# EAGLE design matrix (EAGLE 9.5.2)
CNAME: Control Cube; CREVISION: 01; DESIGNER: Heng Teng Yi
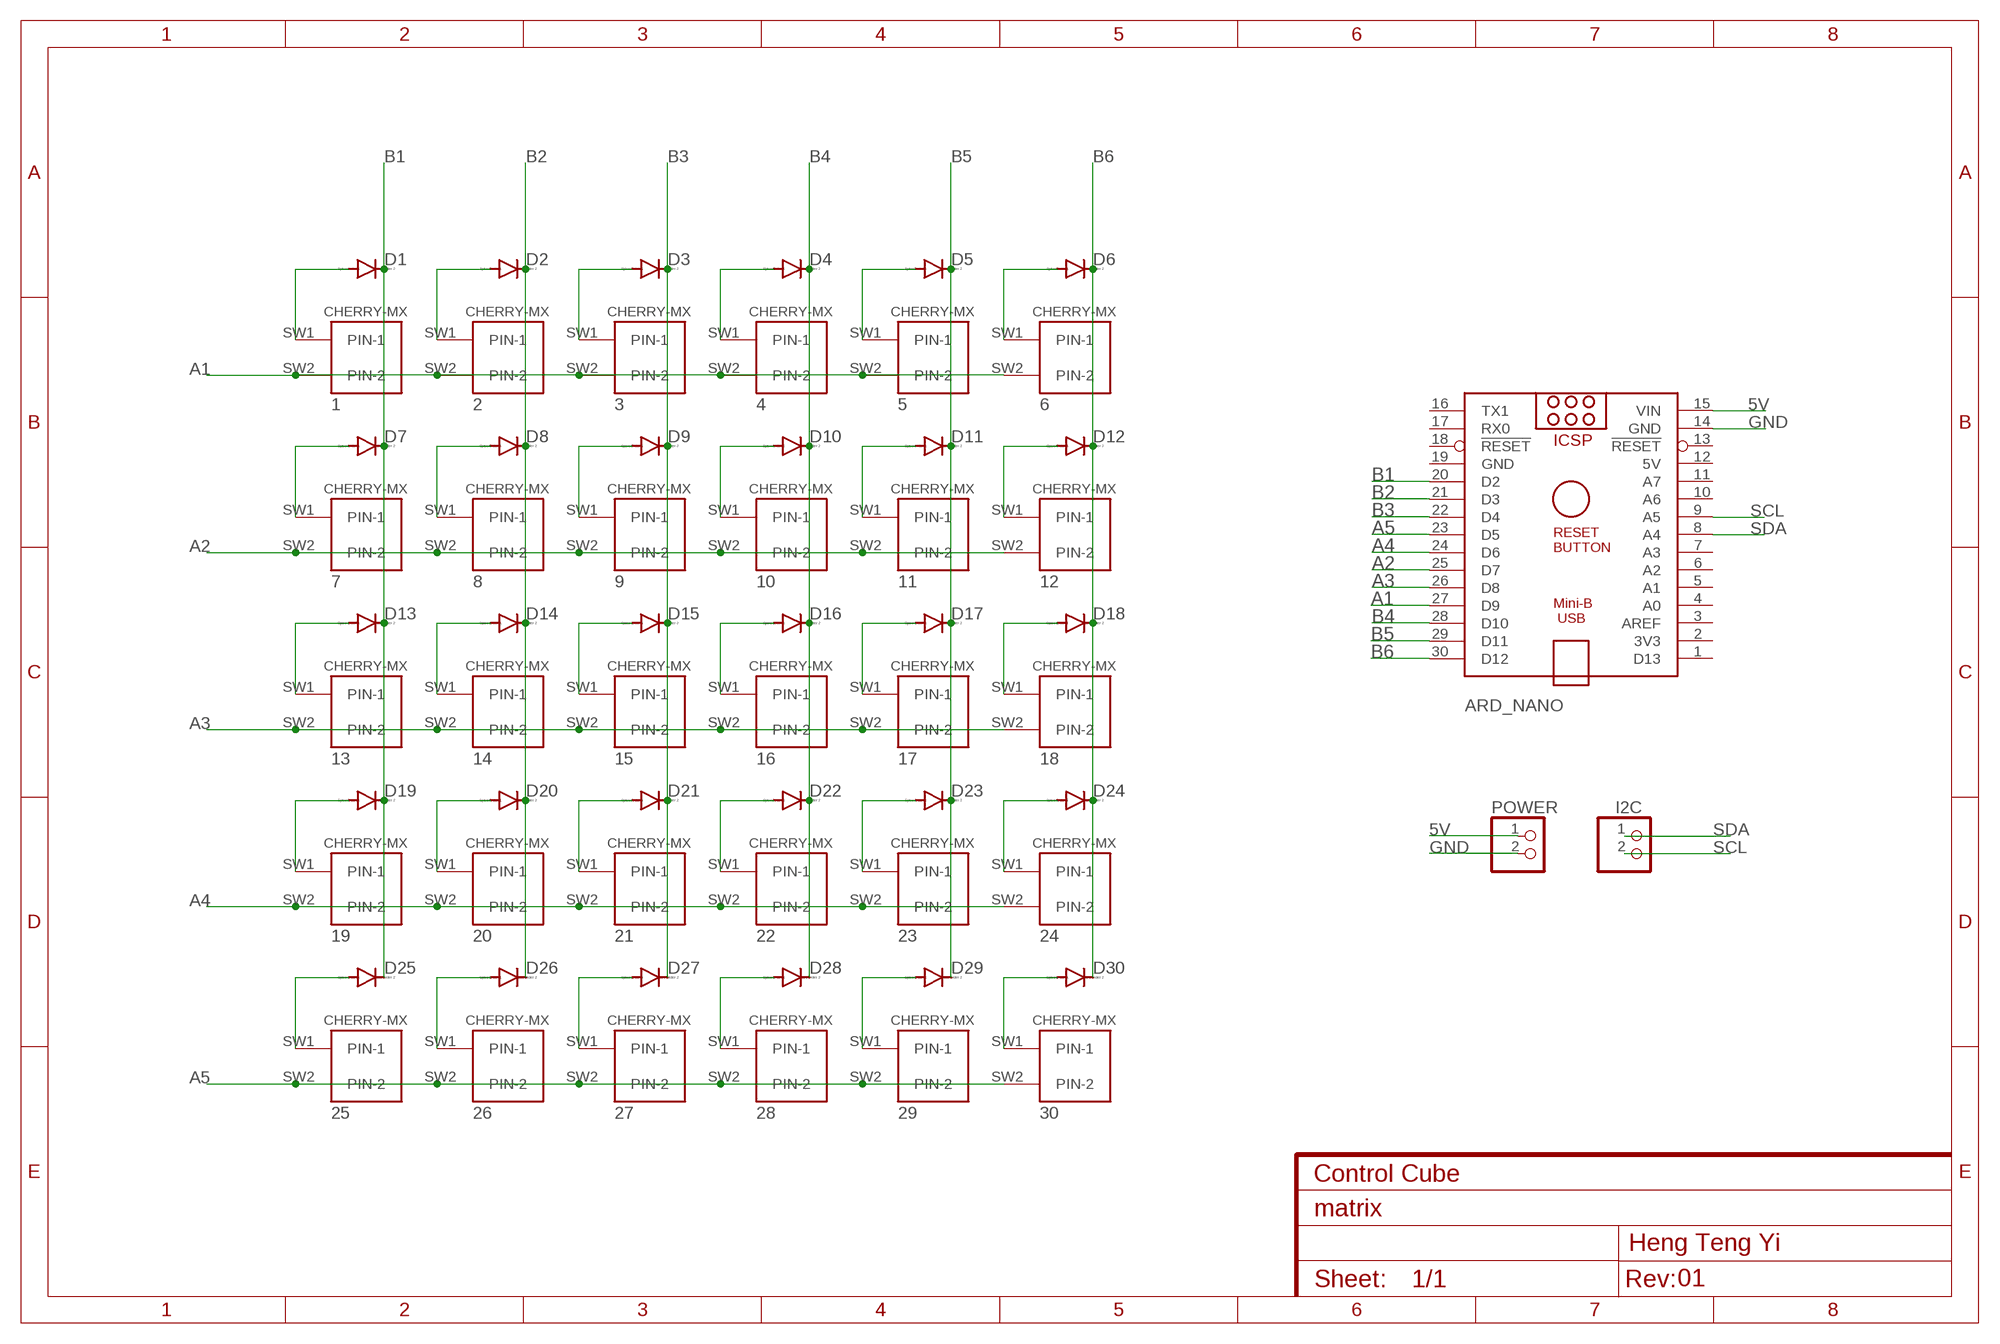
[diagram p0: schematic, sheet 1]

## Parts
1  CHERRY-MX  [CHERRY-MX]
2  CHERRY-MX  [CHERRY-MX]
3  CHERRY-MX  [CHERRY-MX]
4  CHERRY-MX  [CHERRY-MX]
5  CHERRY-MX  [CHERRY-MX]
6  CHERRY-MX  [CHERRY-MX]
7  CHERRY-MX  [CHERRY-MX]
8  CHERRY-MX  [CHERRY-MX]
9  CHERRY-MX  [CHERRY-MX]
10  CHERRY-MX  [CHERRY-MX]
11  CHERRY-MX  [CHERRY-MX]
12  CHERRY-MX  [CHERRY-MX]
13  CHERRY-MX  [CHERRY-MX]
14  CHERRY-MX  [CHERRY-MX]
15  CHERRY-MX  [CHERRY-MX]
16  CHERRY-MX  [CHERRY-MX]
17  CHERRY-MX  [CHERRY-MX]
18  CHERRY-MX  [CHERRY-MX]
19  CHERRY-MX  [CHERRY-MX]
20  CHERRY-MX  [CHERRY-MX]
21  CHERRY-MX  [CHERRY-MX]
22  CHERRY-MX  [CHERRY-MX]
23  CHERRY-MX  [CHERRY-MX]
24  CHERRY-MX  [CHERRY-MX]
25  CHERRY-MX  [CHERRY-MX]
26  CHERRY-MX  [CHERRY-MX]
27  CHERRY-MX  [CHERRY-MX]
28  CHERRY-MX  [CHERRY-MX]
29  CHERRY-MX  [CHERRY-MX]
30  CHERRY-MX  [CHERRY-MX]
ARD_NANO  ARDUINO_NANO  [ARDUINO_NANO]
D1  1N4148DO35-7  [DO35-7]
D2  1N4148DO35-7  [DO35-7]
D3  1N4148DO35-7  [DO35-7]
D4  1N4148DO35-7  [DO35-7]
D5  1N4148DO35-7  [DO35-7]
D6  1N4148DO35-7  [DO35-7]
D7  1N4148DO35-7  [DO35-7]
D8  1N4148DO35-7  [DO35-7]
D9  1N4148DO35-7  [DO35-7]
D10  1N4148DO35-7  [DO35-7]
D11  1N4148DO35-7  [DO35-7]
D12  1N4148DO35-7  [DO35-7]
D13  1N4148DO35-7  [DO35-7]
D14  1N4148DO35-7  [DO35-7]
D15  1N4148DO35-7  [DO35-7]
D16  1N4148DO35-7  [DO35-7]
D17  1N4148DO35-7  [DO35-7]
D18  1N4148DO35-7  [DO35-7]
D19  1N4148DO35-7  [DO35-7]
D20  1N4148DO35-7  [DO35-7]
D21  1N4148DO35-7  [DO35-7]
D22  1N4148DO35-7  [DO35-7]
D23  1N4148DO35-7  [DO35-7]
D24  1N4148DO35-7  [DO35-7]
D25  1N4148DO35-7  [DO35-7]
D26  1N4148DO35-7  [DO35-7]
D27  1N4148DO35-7  [DO35-7]
D28  1N4148DO35-7  [DO35-7]
D29  1N4148DO35-7  [DO35-7]
D30  1N4148DO35-7  [DO35-7]
I2C  PINHD-1X2/90  [1X02/90]
POWER  PINHD-1X2/90  [1X02/90]

## Nets
5V: ARD_NANO.15(VIN) POWER.1
A1: 1.SW2(PIN-2) 2.SW2(PIN-2) 3.SW2(PIN-2) 4.SW2(PIN-2) 5.SW2(PIN-2) 6.SW2(PIN-2) ARD_NANO.27(D9)
A2: 7.SW2(PIN-2) 8.SW2(PIN-2) 9.SW2(PIN-2) 10.SW2(PIN-2) 11.SW2(PIN-2) 12.SW2(PIN-2) ARD_NANO.25(D7)
A3: 13.SW2(PIN-2) 14.SW2(PIN-2) 15.SW2(PIN-2) 16.SW2(PIN-2) 17.SW2(PIN-2) 18.SW2(PIN-2) ARD_NANO.26(D8)
A4: 19.SW2(PIN-2) 20.SW2(PIN-2) 21.SW2(PIN-2) 22.SW2(PIN-2) 23.SW2(PIN-2) 24.SW2(PIN-2) ARD_NANO.24(D6)
A5: 25.SW2(PIN-2) 26.SW2(PIN-2) 27.SW2(PIN-2) 28.SW2(PIN-2) 29.SW2(PIN-2) 30.SW2(PIN-2) ARD_NANO.23(D5)
B1: ARD_NANO.20(D2) D1.C D7.C D13.C D19.C D25.C
B2: ARD_NANO.21(D3) D2.C D8.C D14.C D20.C D26.C
B3: ARD_NANO.22(D4) D3.C D9.C D15.C D21.C D27.C
B4: ARD_NANO.28(D10) D4.C D10.C D16.C D22.C D28.C
B5: ARD_NANO.29(D11) D5.C D11.C D17.C D23.C D29.C
B6: ARD_NANO.30(D12) D6.C D12.C D18.C D24.C D30.C
GND: ARD_NANO.14(GND) POWER.2
N$1: 1.SW1(PIN-1) D1.A
N$2: 2.SW1(PIN-1) D2.A
N$3: 3.SW1(PIN-1) D3.A
N$4: 4.SW1(PIN-1) D4.A
N$5: 5.SW1(PIN-1) D5.A
N$6: 6.SW1(PIN-1) D6.A
N$7: 7.SW1(PIN-1) D7.A
N$8: 8.SW1(PIN-1) D8.A
N$9: 9.SW1(PIN-1) D9.A
N$10: 10.SW1(PIN-1) D10.A
N$11: 11.SW1(PIN-1) D11.A
N$12: 12.SW1(PIN-1) D12.A
N$13: 13.SW1(PIN-1) D13.A
N$14: 14.SW1(PIN-1) D14.A
N$15: 15.SW1(PIN-1) D15.A
N$16: 16.SW1(PIN-1) D16.A
N$17: 17.SW1(PIN-1) D17.A
N$18: 18.SW1(PIN-1) D18.A
N$19: 19.SW1(PIN-1) D19.A
N$20: 20.SW1(PIN-1) D20.A
N$21: 21.SW1(PIN-1) D21.A
N$22: 22.SW1(PIN-1) D22.A
N$23: 23.SW1(PIN-1) D23.A
N$24: 24.SW1(PIN-1) D24.A
N$25: 30.SW1(PIN-1) D30.A
N$26: 29.SW1(PIN-1) D29.A
N$27: 28.SW1(PIN-1) D28.A
N$28: 27.SW1(PIN-1) D27.A
N$29: 25.SW1(PIN-1) D25.A
N$30: 26.SW1(PIN-1) D26.A
SCL: ARD_NANO.9(A5) I2C.2
SDA: ARD_NANO.8(A4) I2C.1
Unconnected: ARD_NANO.1(D13) ARD_NANO.2(3V3) ARD_NANO.3(AREF) ARD_NANO.4(A0) ARD_NANO.5(A1) ARD_NANO.6(A2) ARD_NANO.7(A3) ARD_NANO.10(A6) ARD_NANO.11(A7) ARD_NANO.13(!RESET) ARD_NANO.16(TX1) ARD_NANO.17(RX0) ARD_NANO.18(!RESET)

## Notes on the sheet
- Control Cube
- Heng Teng Yi
- 01

## Power pins joined to a net without a drawn wire
5V: ARD_NANO.12(5V)
GND: ARD_NANO.19(GND)

## Library data of the parts
1-30 = cherrymx:CHERRY-MX: Cherry MX series keyswitch
ARD_NANO = ArduinoNanoV30:ARDUINO_NANO: Arduino Nano V3.0 Overview: The Arduino Nano is a small, complete, and breadboard-friendly board based on the ATmega328 (Arduino Nano 3.x) or ATmega168 (Arduino Nano 2.x). It has more or less the same functionality of the Arduino Duemilanove, but in a different package. It lacks only a DC power jack, and works with a Mini-B USB cable instead of a standard one. The Nano was designed and is being produced by Gravitech. Specifications: Microcontroller Atmel ATmega168 or ATmega328 Operating Voltage (logic level) 5 V Input Voltage (recommended) 7-12 V Input Voltage (limits) 6-20 V Digital I/O Pins 14 (of which 6 provide PWM output) Analog Input Pins 8 DC Current per I/O Pin 40 mA Flash Memory 16 KB (ATmega168) or 32 KB (ATmega328) of which 2 KB used by bootloader SRAM 1 KB (ATmega168) or 2 KB (ATmega328) EEPROM 512 bytes (ATmega168) or 1 KB (ATmega328) Clock Speed 16 MHz Dimensions 0.73" x 1.70" Length 45 mm Width 18 mm Weigth 5 g Power: The Arduino Nano can be powered via the Mini-B USB connection, 6-20V unregulated external power supply (pin 30), or 5V regulated external power supply (pin 27). The power source is automatically selected to the highest voltage source. Memory: The ATmega168 has 16 KB of flash memory for storing code (of which 2 KB is used for the bootloader); the ATmega328 has 32 KB, (also with 2 KB used for the bootloader). The ATmega168 has 1 KB of SRAM and 512 bytes of EEPROM (which can be read and written with the EEPROM library); the ATmega328 has 2 KB of SRAM and 1 KB of EEPROM. Input and Output: Each of the 14 digital pins on the Nano can be used as an input or output, using pinMode(), digitalWrite(), and digitalRead() functions. They operate at 5 volts. Each pin can provide or receive a maximum of 40 mA and has an internal pull-up resistor (disconnected by default) of 20-50 kOhms. In addition, some pins have specialized functions. Visit Arduino - ArduinoBoardNano <https://www.arduino.cc/en/Main/ArduinoBoardNano>
D1-D30 = diode:1N4148: DIODE high speed (Philips)
I2C POWER = pinhead:PINHD-1X2: PIN HEADER

## Board
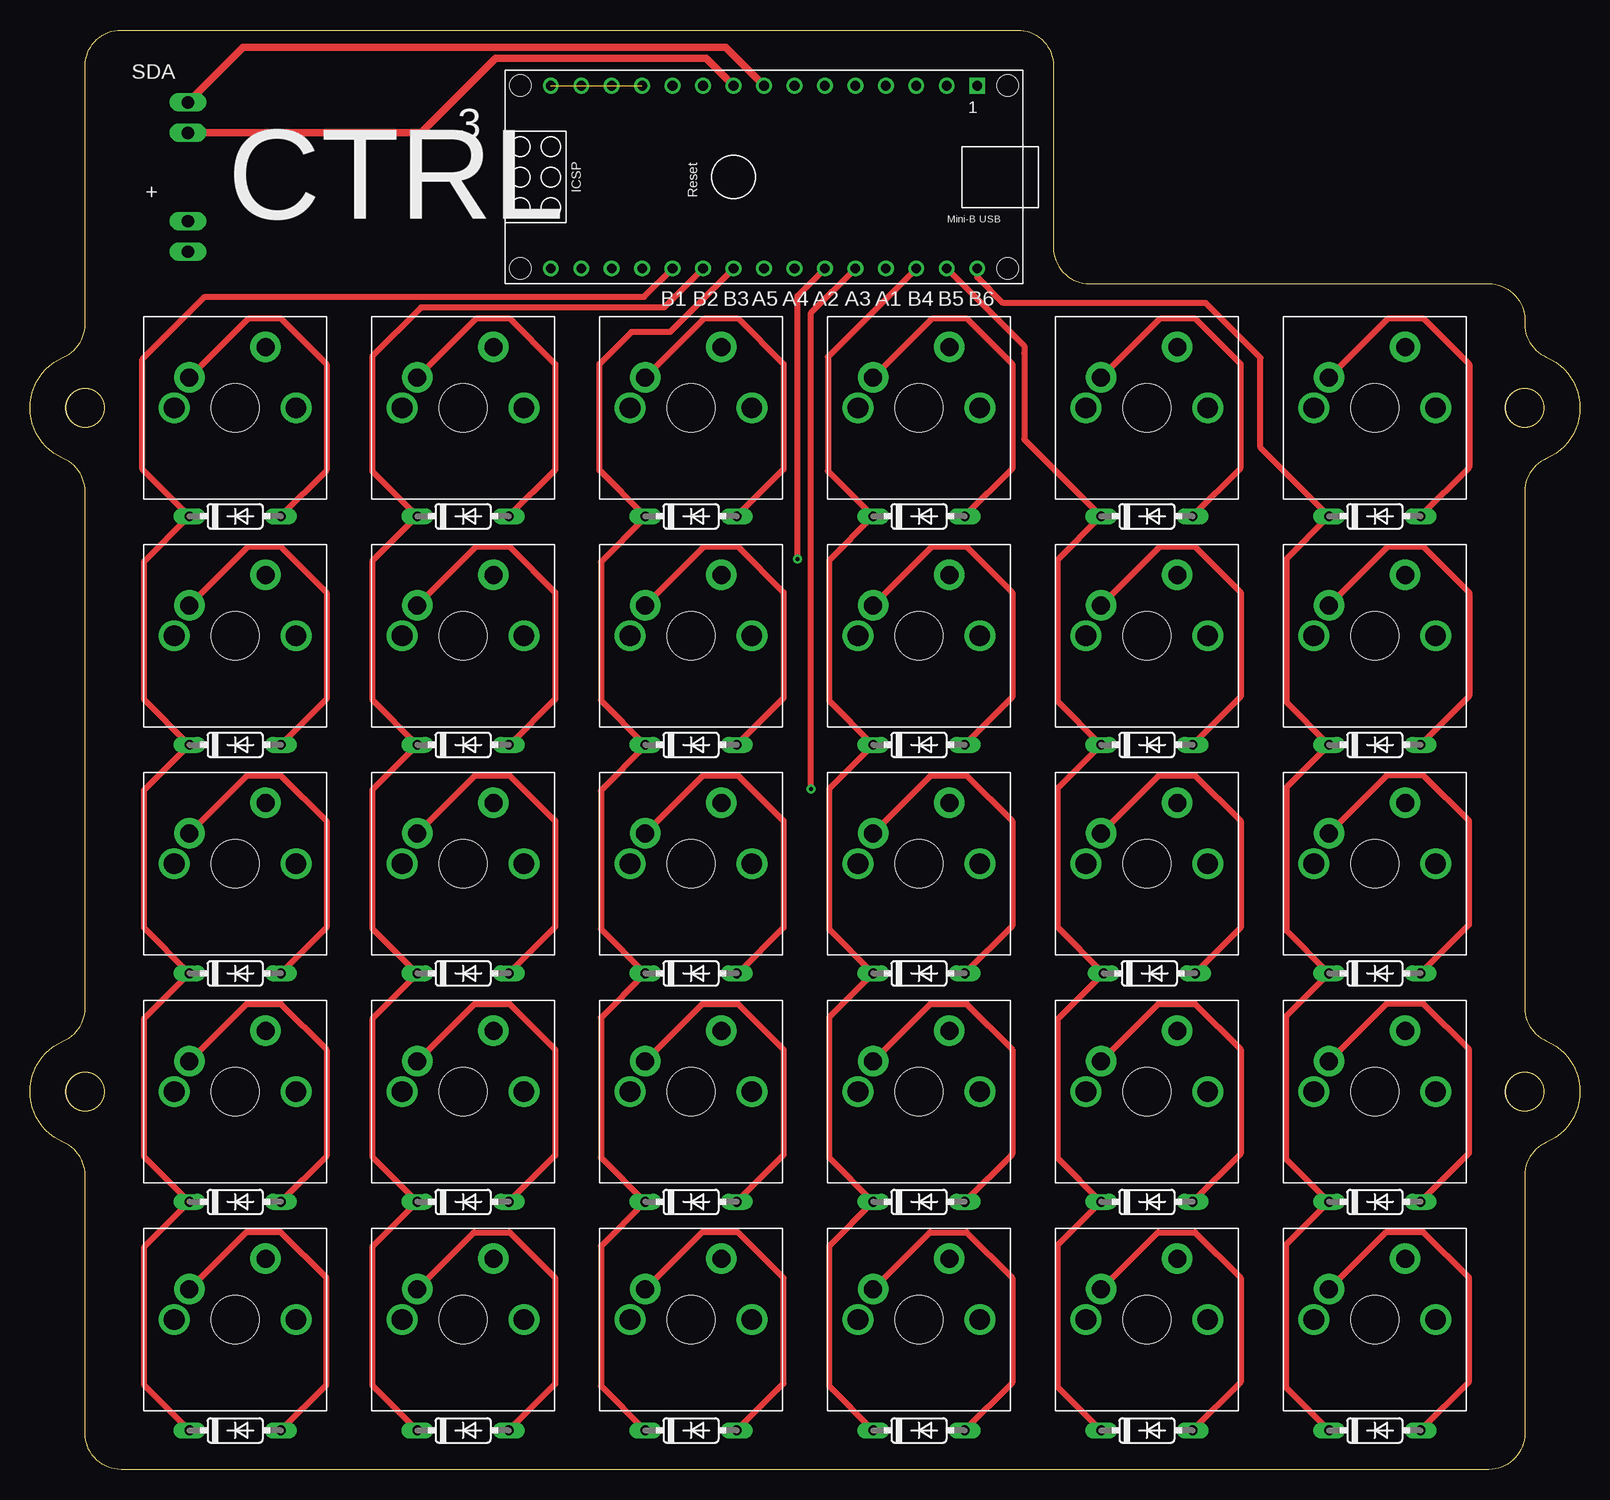
[diagram p1: board, top side]
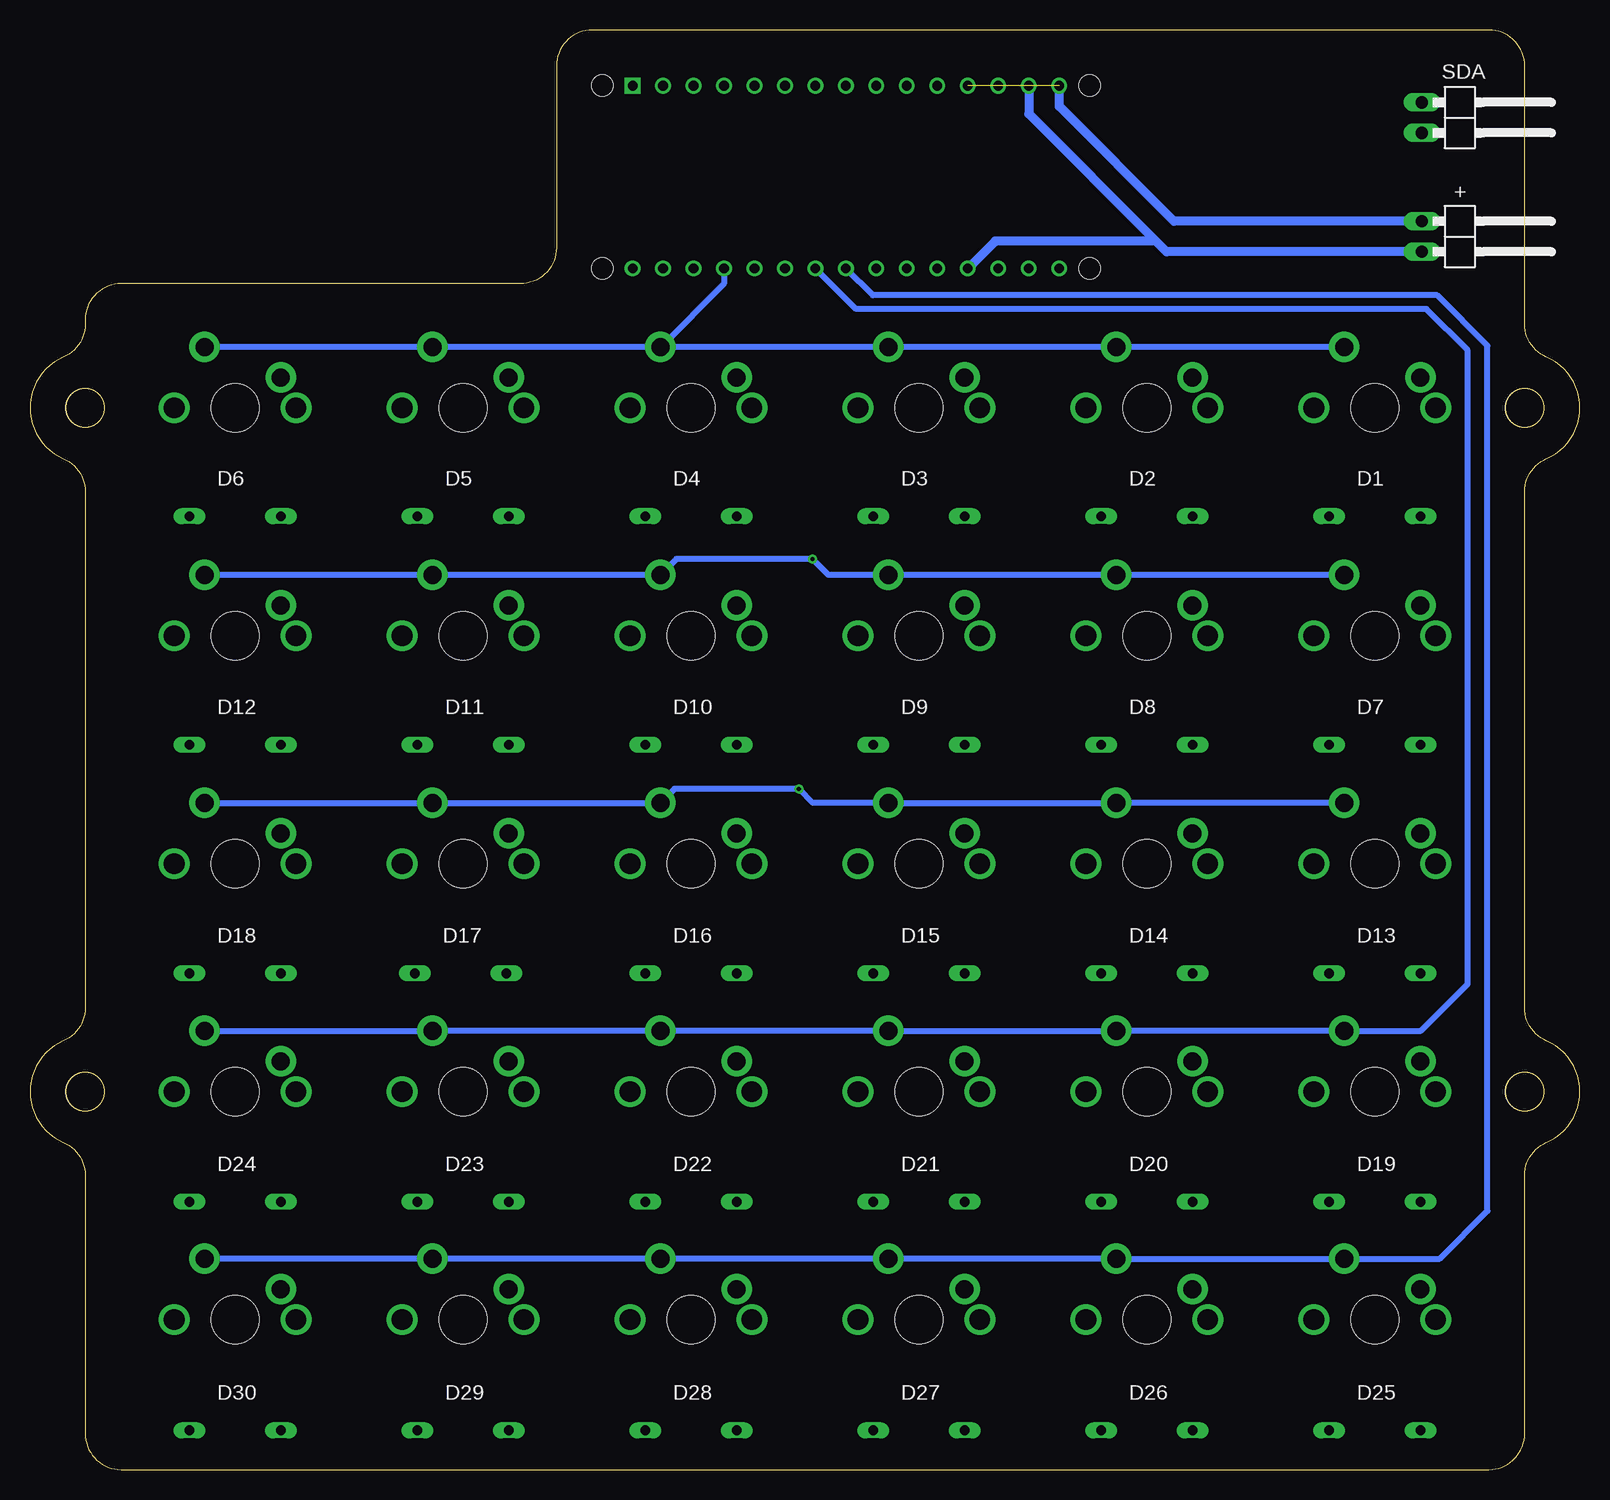
[diagram p2: board, bottom side, seen from below]

Size 129.2 x 120 mm. Coordinates in mm from the lower left corner, seen from the top.
Outline: 88.32,98.85 121.6,98.85 arc-90 124.6,95.85 124.6,95.48 arc67 126.42,92.73 arc-134 126.42,84.27 arc67 124.6,81.52 124.6,38.48 arc67 126.42,35.73 arc-134 126.42,27.27 arc67 124.6,24.52 124.6,3 arc-90 121.6,0 7.6,0 arc-90 4.6,3 4.6,24.52 arc67 2.78,27.27 arc-134 2.78,35.73 arc67 4.6,38.48 4.6,81.52 arc67 2.78,84.27 arc-134 2.78,92.73 arc67 4.6,95.48 4.6,117 arc-90 7.6,120 82.32,120 arc-90 85.32,117 85.32,101.85 arc90 88.32,98.85
Outline: circle at 4.6,31.5 radius 1.6
Outline: circle at 4.6,88.5 radius 1.6
Outline: circle at 124.6,31.5 radius 1.6
Outline: circle at 124.6,88.5 radius 1.6
Copper layers (1*16): Top 0.035mm / dielectric 1.5mm / Bottom 0.035mm
Design rules "default": minimum track width 6mil, minimum drill 0.35mm, track to track 6mil, track to pad 6mil, pad to pad 6mil, via to via 6mil, smd to smd 6mil, copper to edge 40mil, drill to drill 6mil, minimum pad ring 10mil, minimum via ring 8mil, stop-mask expansion 4mil, vias tented up to drill 0mil, thermal gap 10mil
Holes 3.2 mm at 4.6,88.5 4.6,31.5 124.6,31.5 124.6,88.5

### Footprints (pad centres in the part's own frame; a part is rotated, then mirrored left to right if it is on the bottom)
CHERRY-MX = drill 1.714 pad 1.93: P$3 -5.08,0; P$4 5.08,0 | drill 1.5 pad 2.54: SW1 -3.81,2.54; SW2 2.54,5.08 | hole 4: 0,0
ARDUINO_NANO = drill 0.8 square: 1 -20.32,-7.62 | drill 0.8: 2 -17.78,-7.62; 3 -15.24,-7.62; 4 -12.7,-7.62; 5 -10.16,-7.62; 6 -7.62,-7.62; 7 -5.08,-7.62; 8 -2.54,-7.62; 9 0,-7.62; 10 2.54,-7.62; 11 5.08,-7.62; 12 7.62,-7.62; 13 10.16,-7.62; 14 12.7,-7.62; 15 15.24,-7.62; 16 15.24,7.62; 17 12.7,7.62; 18 10.16,7.62; 19 7.62,7.62; 20 5.08,7.62; 21 2.54,7.62; 22 0,7.62; 23 -2.54,7.62; 24 -5.08,7.62; 25 -7.62,7.62; 26 -10.16,7.62; 27 -12.7,7.62; 28 -15.24,7.62; 29 -17.78,7.62; 30 -20.32,7.62 | hole 1.778: -22.86,-7.62; -22.86,7.62; 17.78,7.62; 17.78,-7.62
DO35-7 = drill 0.813 long: A 3.81,0; C -3.81,0
1X02/90 = drill 1.016 long: 1 -1.27,-3.81; 2 1.27,-3.81

### Placement (x,y rotation side)
1  17.1,88.5 0 top
2  36.1,88.5 0 top
3  55.1,88.5 0 top
4  74.1,88.5 0 top
5  93.1,88.5 0 top
6  112.1,88.5 0 top
7  17.1,69.5 0 top
8  36.1,69.5 0 top
9  55.1,69.5 0 top
10  74.1,69.5 0 top
11  93.1,69.5 0 top
12  112.1,69.5 0 top
13  17.1,50.5 0 top
14  36.1,50.5 0 top
15  55.1,50.5 0 top
16  74.1,50.5 0 top
17  93.1,50.5 0 top
18  112.1,50.5 0 top
19  17.1,31.5 0 top
20  36.1,31.5 0 top
21  55.1,31.5 0 top
22  74.1,31.5 0 top
23  93.1,31.5 0 top
24  112.1,31.5 0 top
25  17.1,12.5 0 top
26  36.1,12.5 0 top
27  55.1,12.5 0 top
28  74.1,12.5 0 top
29  93.1,12.5 0 top
30  112.1,12.5 0 top
ARD_NANO  58.65,107.74 180 top
D1  17.1,79.46 0 top
D2  36.1,79.46 0 top
D3  55.1,79.46 0 top
D4  74.1,79.46 0 top
D5  93.1,79.46 0 top
D6  112.1,79.46 0 top
D7  17.1,60.41 0 top
D8  36.1,60.41 0 top
D9  55.1,60.41 0 top
D10  74.1,60.41 0 top
D11  93.1,60.41 0 top
D12  112.1,60.41 0 top
D13  17.1,41.36 0 top
D14  36.1,41.36 0 top
D15  55.1,41.36 0 top
D16  74.1,41.36 0 top
D17  93.31,41.36 0 top
D18  112.1,41.36 0 top
D19  17.1,22.31 0 top
D20  36.1,22.31 0 top
D21  55.1,22.31 0 top
D22  74.1,22.31 0 top
D23  93.1,22.31 0 top
D24  112.1,22.31 0 top
D25  17.1,3.26 0 top
D26  36.1,3.26 0 top
D27  55.1,3.26 0 top
D28  74.1,3.26 0 top
D29  93.1,3.26 0 top
D30  112.1,3.26 0 top
I2C  9.36,112.69 270 bottom
POWER  9.36,102.78 270 bottom

### Tracks (layer width: path | path; a pad name or v marks a point on that pad's centre or on a via)
5V  (1 unrouted)
  Bottom 0.762: POWER.1 33.83,104.05 43.41,113.63 ARD_NANO.15
A1
  Bottom 0.508: 1.SW2 2.SW2 3.SW2 4.SW2 | 4.SW2 5.SW2 6.SW2 | ARD_NANO.27 71.35,98.85 76.61,93.58 4.SW2
A2  (via drill 0.35)
  Top 0.508: v63.97,75.91 63.97,97.82 ARD_NANO.25
  Bottom 0.508: 7.SW2 8.SW2 9.SW2 62.64,74.58 v63.97,75.91 75.31,75.91 10.SW2 11.SW2 12.SW2
A3  (via drill 0.35)
  Top 0.508: v65.11,56.73 65.11,96.42 ARD_NANO.26
  Bottom 0.508: 18.SW2 17.SW2 16.SW2 75.49,56.73 v65.11,56.73 63.96,55.58 15.SW2 14.SW2 13.SW2
A4
  Bottom 0.508: 24.SW2 23.SW2 22.SW2 21.SW2 20.SW2 19.SW2 13.25,36.58 9.36,40.47 9.36,93.31 12.79,96.74 60.35,96.74 ARD_NANO.24
A5
  Bottom 0.508: 30.SW2 29.SW2 28.SW2 27.SW2 26.SW2 25.SW2 11.68,17.58 7.71,21.55 7.71,93.69 11.9,97.88 58.95,97.88 ARD_NANO.23
B1
  Top 0.508: D25.C 9.49,7.07 9.49,18.5 D19.C 9.49,26.12 9.49,37.56 D13.C 9.49,45.17 9.49,56.61 D7.C 9.49,64.22 9.49,75.66 D1.C 9.36,83.39 9.36,92.54 14.57,97.75 51.2,97.75 ARD_NANO.20
B2
  Top 0.508: D26.C 28.54,7.02 28.54,18.56 D20.C 28.54,26.07 28.54,37.55 32.29,41.31 D14.C 28.54,45.12 28.54,56.66 D8.C 28.54,64.17 28.54,75.71 D2.C 28.54,83.22 28.54,92.8 32.6,96.86 52.85,96.86 ARD_NANO.21
B3
  Top 0.508: D27.C 47.59,6.97 47.59,18.61 D21.C 47.59,26.02 47.59,37.66 D15.C 47.59,45.07 47.59,56.6 51.29,60.31 D9.C 47.59,64.12 47.59,75.65 51.29,79.36 D3.C 47.46,83.29 47.46,92.16 50.13,94.83 53.36,94.83 ARD_NANO.22
B4
  Top 0.508: D28.C 66.64,6.92 66.64,18.66 D22.C 66.64,25.97 66.64,37.71 D16.C 66.64,45.02 66.64,56.76 D10.C 66.64,64.07 66.64,75.81 D4.C 66.51,83.24 66.51,92.74 ARD_NANO.28
B5
  Top 0.508: D29.C 85.69,6.87 85.69,18.71 D23.C 85.69,25.92 85.69,37.55 D17.C 85.69,45.17 85.69,56.81 D11.C 85.69,64.02 85.69,75.86 D5.C 82.89,85.86 82.89,93.05 82.89,93.65 ARD_NANO.29
B6
  Top 0.508: D30.C 104.74,6.82 104.74,18.76 D24.C 104.74,25.87 104.74,37.81 D18.C 104.74,44.92 104.74,56.86 D12.C 104.74,63.97 104.74,75.91 D6.C 102.58,85.18 102.58,92.67 98.01,97.24 81.11,97.24 78.97,99.39 ARD_NANO.30
GND
  Bottom 0.762: POWER.2 34.46,101.51 35.35,102.4 | 35.35,102.4 48.74,102.4 ARD_NANO.19 | ARD_NANO.14 45.95,113 35.35,102.4
N$1
  Top 0.508: 1.SW1 18.22,95.97 20.92,95.97 24.73,92.16 24.73,83.28 D1.A
N$2
  Top 0.508: 2.SW1 37.22,95.97 39.97,95.97 43.78,92.16 43.78,83.33 D2.A
N$3
  Top 0.508: 3.SW1 56.22,95.97 59.02,95.97 62.83,92.16 62.83,83.38 D3.A
N$4
  Top 0.508: 4.SW1 75.22,95.97 78.07,95.97 81.88,92.16 81.88,83.43 D4.A
N$5
  Top 0.508: 5.SW1 94.22,95.97 97.12,95.97 100.93,92.16 100.93,83.48 D5.A
N$6
  Top 0.508: 6.SW1 113.22,95.97 116.17,95.97 119.98,92.16 119.98,83.53 D6.A
N$7
  Top 0.508: 7.SW1 18.17,76.92 20.92,76.92 24.73,73.11 24.73,64.22 D7.A
N$8
  Top 0.508: 8.SW1 37.17,76.92 39.97,76.92 43.78,73.11 43.78,64.22 39.97,60.41 D8.A
N$9
  Top 0.508: 9.SW1 56.17,76.92 59.02,76.92 62.83,73.11 62.83,64.33 D9.A
N$10
  Top 0.508: 10.SW1 75.17,76.92 78.07,76.92 81.88,73.11 81.88,64.38 D10.A
N$11
  Top 0.508: 11.SW1 94.17,76.92 97.12,76.92 100.93,73.11 100.93,64.43 D11.A
N$12
  Top 0.508: 12.SW1 113.17,76.92 116.17,76.92 119.98,73.11 119.98,64.48 D12.A
N$13
  Top 0.508: 13.SW1 18.12,57.87 20.92,57.87 24.73,54.06 24.73,45.18 D13.A
N$14
  Top 0.508: 14.SW1 37.12,57.87 39.97,57.87 43.78,54.06 43.78,45.23 D14.A
N$15
  Top 0.508: 15.SW1 56.12,57.87 59.02,57.87 62.83,54.06 62.83,45.17 59.02,41.36 D15.A
N$16
  Top 0.508: 16.SW1 75.12,57.87 78.07,57.87 81.88,54.06 81.88,45.33 D16.A
N$17
  Top 0.508: 17.SW1 94.12,57.87 97.12,57.87 100.93,54.06 100.93,45.17 D17.A
N$18
  Top 0.508: D18.A 119.98,45.43 119.98,54.06 116.17,57.87 113.12,57.87 18.SW1
N$19
  Top 0.508: 19.SW1 18.07,38.82 20.92,38.82 24.73,35.01 24.73,26.12 D19.A
N$20
  Top 0.508: 20.SW1 37.07,38.82 39.97,38.82 43.78,35.01 43.78,26.18 D20.A
N$21
  Top 0.508: 21.SW1 56.07,38.82 59.02,38.82 62.83,35.01 62.83,26.23 D21.A
N$22
  Top 0.508: 22.SW1 75.07,38.82 78.07,38.82 81.88,35.01 81.88,26.28 D22.A
N$23
  Top 0.508: 23.SW1 94.07,38.82 97.12,38.82 100.93,35.01 100.93,26.33 D23.A
N$24
  Top 0.508: D24.A 119.98,26.38 119.98,35.01 116.17,38.82 113.07,38.82 24.SW1
N$25
  Top 0.508: D30.A 119.98,7.33 119.98,15.96 116.17,19.77 113.02,19.77 30.SW1
N$26
  Top 0.508: 29.SW1 94.02,19.77 97.12,19.77 100.93,15.96 100.93,7.28 D29.A
N$27
  Top 0.508: 28.SW1 75.02,19.77 78.07,19.77 81.88,15.96 81.88,7.23 D28.A
N$28
  Top 0.508: D27.A 62.83,7.18 62.83,15.96 59.02,19.77 56.02,19.77 27.SW1
N$29
  Top 0.508: D25.A 24.73,7.08 24.73,15.96 20.92,19.77 18.02,19.77 25.SW1
N$30
  Top 0.508: 26.SW1 37.02,19.77 39.97,19.77 43.78,15.96 43.78,7.13 D26.A
SCL
  Top 0.61: ARD_NANO.9 56.36,117.64 38.82,117.64 32.6,111.42 I2C.2
SDA
  Top 0.61: ARD_NANO.8 57.96,118.58 17.79,118.58 I2C.1

### Text on the board
tPlace: SDA | 3 | + | CTRL | B1 | B2 | B3 | A5 | A4 | A2 | A3 | A1 | B4 | B5 | B6
bPlace: SDA | +